# EAGLE design socket (EAGLE 7.2.0)

## Sheet 1 of 7
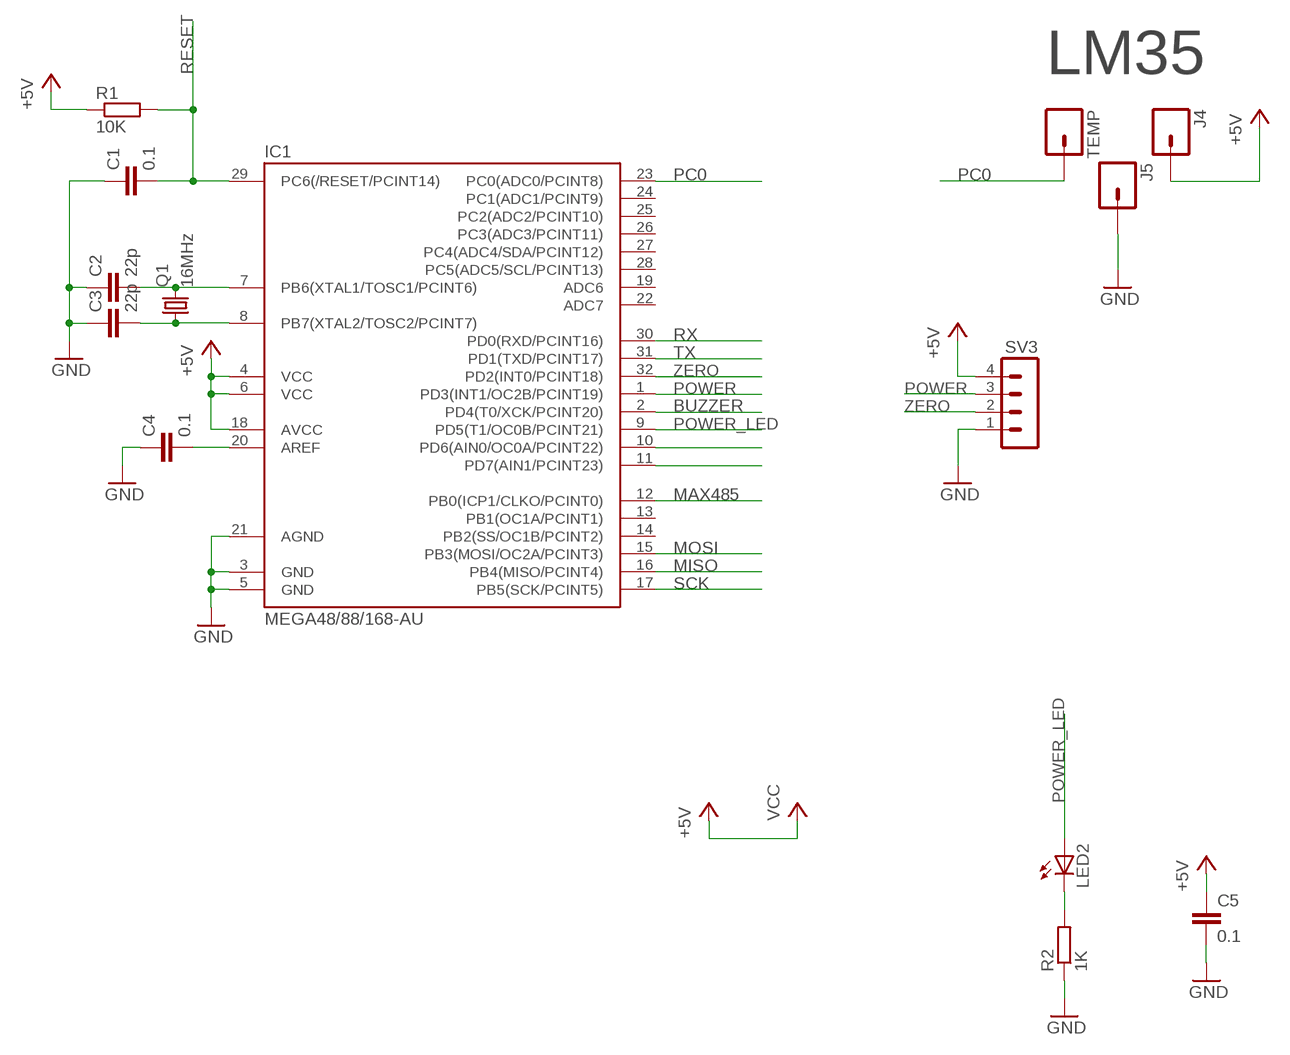
[diagram p0: schematic, sheet 1]

### Parts
C1  0.1  C-EUC0805  [C0805]
C2  22p  C-EUC0805  [C0805]
C3  22p  C-EUC0805  [C0805]
C4  0.1  C-EUC0805  [C0805]
C5  0.1  C-EUC0805  [C0805]
IC1  MEGA48/88/168-AU  [TQFP32-08]
J4  M01PTH_NO_SILK_YES_STOP  [1X01_NO_SILK]
J5  M01PTH_NO_SILK_YES_STOP  [1X01_NO_SILK]
LED2  LEDCHIPLED_0805  [CHIPLED_0805]
Q1  16MHz  CRYSTALHC49U70  [HC49U70]
R1  10K  R-EU_R0805  [R0805]
R2  1K  R-EU_R0805  [R0805]
SV3  MA04-1  [MA04-1]
TEMP  M01PTH_NO_SILK_YES_STOP  [1X01_NO_SILK]

### Nets
+5V: C5.1 IC1.4(VCC) IC1.6(VCC) IC1.18(AVCC) J4.1 R1.1 SV3.4 ; supply symbol labelled VCC ; also sheet 2,4,5,7
BUZZER: IC1.2(PD4(T0/XCK/PCINT20)) ; also sheet 5
GND: C1.1 C2.1 C3.1 C4.1 C5.2 IC1.3(GND) IC1.5(GND) IC1.21(AGND) J5.1 R2.1 SV3.1 ; also sheet 2,4,5,7
MISO: IC1.16(PB4(MISO/PCINT4)) ; also sheet 2
MOSI: IC1.15(PB3(MOSI/OC2A/PCINT3)) ; also sheet 2
N$2: C4.2 IC1.20(AREF)
N$3: C2.2 IC1.7(PB6(XTAL1/TOSC1/PCINT6)) Q1.2
N$4: C3.2 IC1.8(PB7(XTAL2/TOSC2/PCINT7)) Q1.1
N$5: LED2.C R2.2
N$89: IC1.10(PD6(AIN0/OC0A/PCINT22))
N$90: IC1.11(PD7(AIN1/PCINT23))
PB0: IC1.12(PB0(ICP1/CLKO/PCINT0)) ; also sheet 7
PC0: IC1.23(PC0(ADC0/PCINT8)) TEMP.1
PD3: IC1.1(PD3(INT1/OC2B/PCINT19)) SV3.3
PD4: IC1.32(PD2(INT0/PCINT18)) SV3.2
POWER_LED: IC1.9(PD5(T1/OC0B/PCINT21)) LED2.A
RESET: C1.2 IC1.29(PC6(/RESET/PCINT14)) R1.2 ; also sheet 2
RX: IC1.30(PD0(RXD/PCINT16)) ; also sheet 7
SCK: IC1.17(PB5(SCK/PCINT5)) ; also sheet 2
TX: IC1.31(PD1(TXD/PCINT17)) ; also sheet 7
Unconnected: IC1.13(PB1(OC1A/PCINT1)) IC1.14(PB2(SS/OC1B/PCINT2)) IC1.19(ADC6) IC1.22(ADC7) IC1.24(PC1(ADC1/PCINT9)) IC1.25(PC2(ADC2/PCINT10)) IC1.26(PC3(ADC3/PCINT11)) IC1.27(PC4(ADC4/SDA/PCINT12)) IC1.28(PC5(ADC5/SCL/PCINT13))

### Notes on the sheet
- RESET | LM35
- PC0 | PC0
- RX
- TX
- ZERO
- POWER | POWER
- BUZZER | ZERO
- POWER_LED
- MAX485
- MOSI
- MISO
- SCK
- POWER_LED

## Sheet 2 of 7
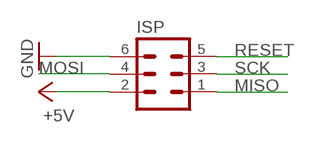
[diagram p1: schematic, sheet 2]

### Parts
ISP  MA03-2  [MA03-2]

### Nets
+5V: ISP.2 ; also sheet 1,4,5,7
GND: ISP.6 ; also sheet 1,4,5,7
MISO: ISP.1 ; also sheet 1
MOSI: ISP.4 ; also sheet 1
RESET: ISP.5 ; also sheet 1
SCK: ISP.3 ; also sheet 1

### Notes on the sheet
- RESET
- MOSI | SCK
- MISO

## Sheet 3 of 7
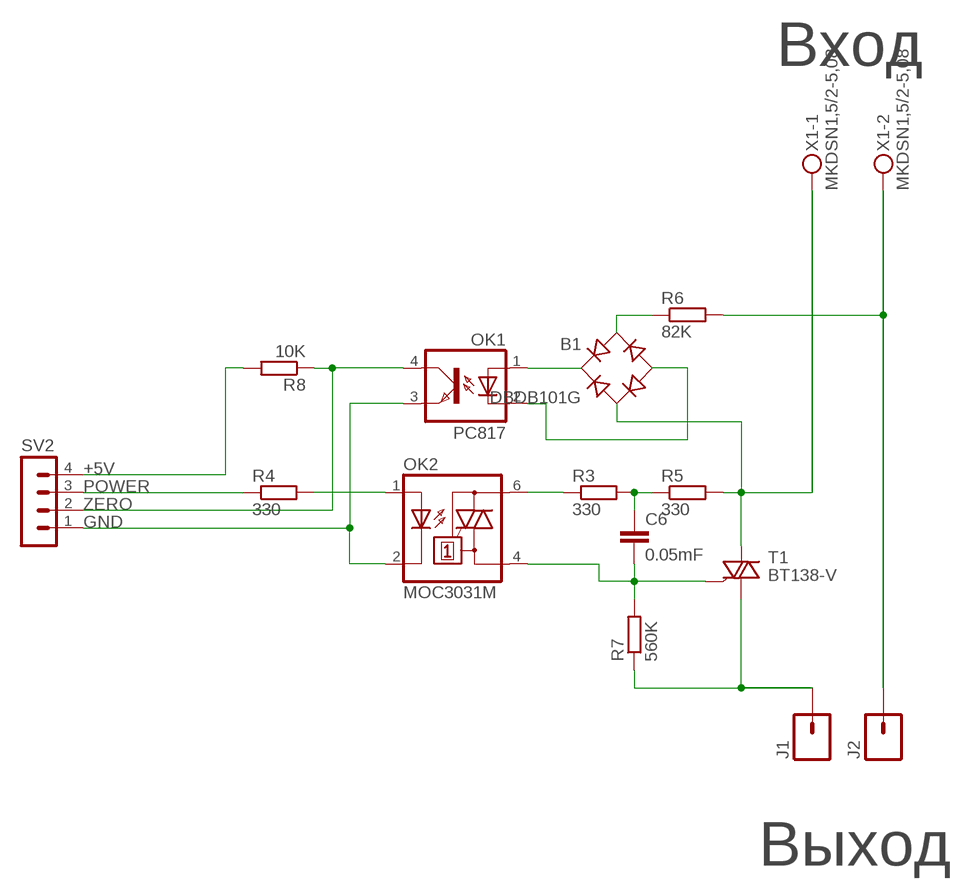
[diagram p2: schematic, sheet 3]

### Parts
B1  DBDB101G  [DB]
C6  0.05mF  C-EUC0805  [C0805]
J1  M01NOSILK-KIT  [1X01NS-KIT]
J2  M01NOSILK-KIT  [1X01NS-KIT]
OK1  PC817  [DIL04]
OK2  MOC3031M  [DIL06]
R3  330  R-EU_M0805  [M0805]
R4  330  R-EU_M0805  [M0805]
R5  330  R-EU_M0805  [M0805]
R6  82K  R-EU_0309/10  [0309/10]
R7  560K  R-EU_M0805  [M0805]
R8  10K  R-EU_M0805  [M0805]
SV2  MA04-1  [MA04-1]
T1  BT138-V  [TO220BV]
X1  MKDSN1,5/2-5,08  [MKDSN1,5/2-5,08]

### Nets
N$1: B1.AC2 R5.2 T1.T2(A2) X1.1
N$6: OK2.6(A2) R3.1
N$7: C6.2 OK2.4(A1) R7.2 T1.G
N$8: J1.1 R7.1 T1.T1(A1)
N$9: OK2.1(A) R4.2
N$12: J2.1 R6.2 X1.2
N$13: C6.1 R3.2 R5.1
N$14: B1.+ OK1.1(A)
N$15: B1.- OK1.2(C)
N$16: B1.AC1 R6.1
N$17: R8.2 SV2.4
N$19: OK1.3(EMIT) OK2.2(C) SV2.1
POWER: R4.1 SV2.3
ZERO: OK1.4(COL) R8.1 SV2.2

### Notes on the sheet
- Вход
- +5V
- POWER
- ZERO
- GND
- Выход

## Sheet 4 of 7
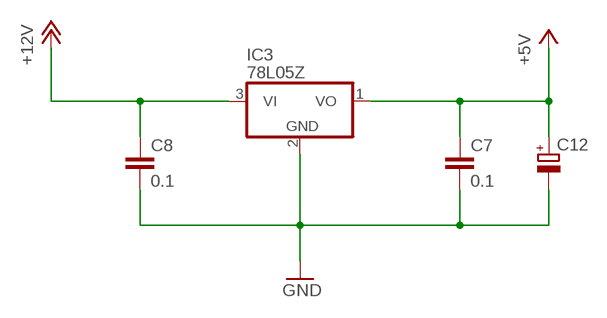
[diagram p3: schematic, sheet 4]

### Parts
C7  0.1  C-EUC0805  [C0805]
C8  0.1  C-EUC0805  [C0805]
C12  CPOL-EUE2,5-6E  [E2,5-6E]
IC3  78L05Z  [TO92]

### Nets
+5V: C7.1 C12.+ IC3.1(VO) ; also sheet 1,2,5,7
+12V: C8.1 IC3.3(VI) ; also sheet 7
GND: C7.2 C8.2 C12.- IC3.2(GND) ; also sheet 1,2,5,7

## Sheet 5 of 7
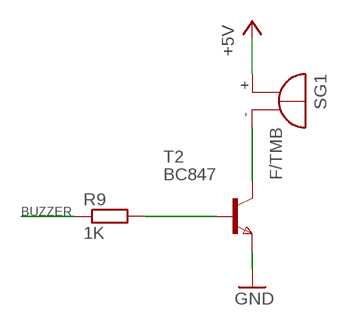
[diagram p4: schematic, sheet 5]

### Parts
R9  1K  R-EU_M1206  [M1206]
SG1  F/TMB  [F/TMB]
T2  BC847  NPNSOT23  [SOT-23]

### Nets
+5V: SG1.+ ; also sheet 1,2,4,7
BUZZER: R9.1 ; also sheet 1
GND: T2.2(E) ; also sheet 1,2,4,7
N$18: R9.2 T2.3(B)
SPEAKER-: SG1.- T2.1(C)

### Notes on the sheet
- BUZZER

## Sheet 6 of 7
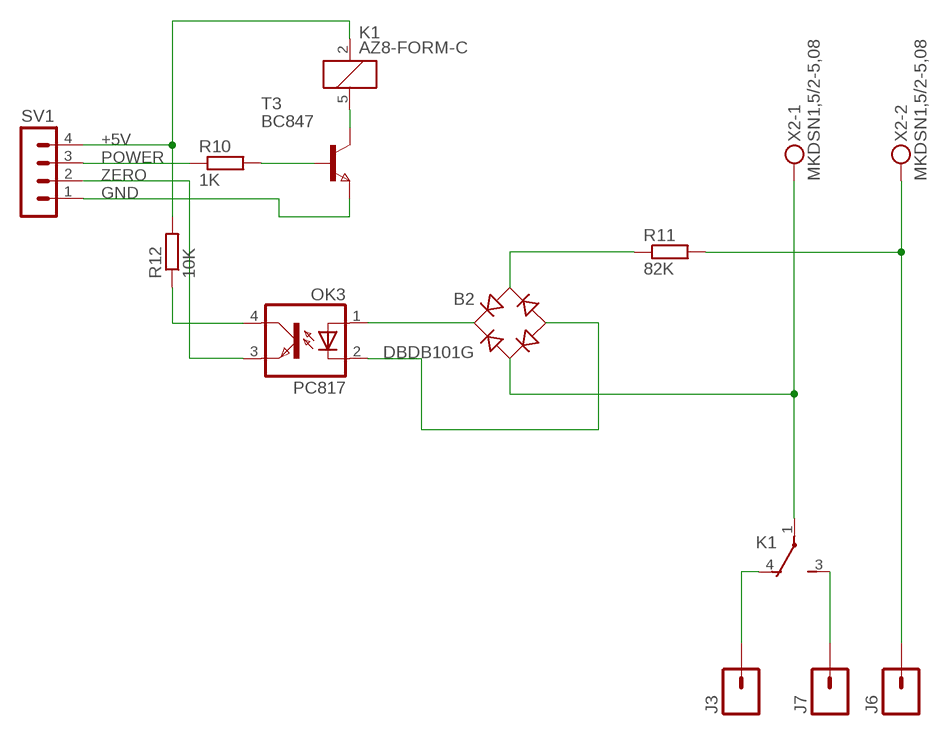
[diagram p5: schematic, sheet 6]

### Parts
B2  DBDB101G  [DB]
J3  M01NOSILK-KIT  [1X01NS-KIT]
J6  M01NOSILK-KIT  [1X01NS-KIT]
J7  M01NOSILK-KIT  [1X01NS-KIT]
K1  AZ8-FORM-C  [AZ8]
OK3  PC817  [DIL04]
R10  1K  R-EU_M0805  [M0805]
R11  82K  R-EU_0309/10  [0309/10]
R12  10K  R-EU_M0805  [M0805]
SV1  MA04-1  [MA04-1]
T3  BC847  NPNSOT23  [SOT-23]
X2  MKDSN1,5/2-5,08  [MKDSN1,5/2-5,08]

### Nets
N$58: R10.1 SV1.3
N$59: R10.2 T3.3(B)
N$60: K1.5 T3.1(C)
N$61: K1.2 R12.2 SV1.4
N$62: J7.1 K1.3(-1:S)
N$63: J3.1 K1.4(-1:O)
N$64: J6.1 R11.2 X2.2
N$65: SV1.1 T3.2(E)
N$66: OK3.4(COL) R12.1
N$67: OK3.3(EMIT) SV1.2
N$68: B2.+ OK3.1(A)
N$69: B2.- OK3.2(C)
N$70: B2.AC1 R11.1
N$71: B2.AC2 K1.1(-1:P) X2.1

### Notes on the sheet
- +5V
- POWER
- ZERO
- GND

## Sheet 7 of 7
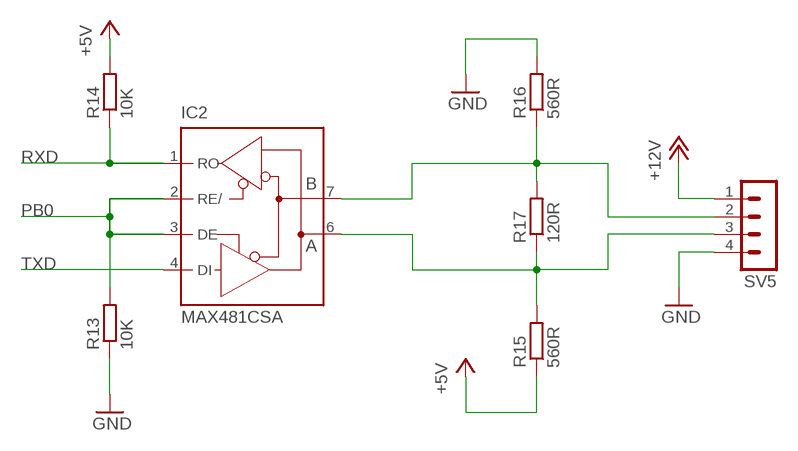
[diagram p6: schematic, sheet 7]

### Parts
IC2  MAX481CSA  [SO08]
R13  10K  R-EU_R0805  [R0805]
R14  10K  R-EU_R0805  [R0805]
R15  560R  R-EU_R0805  [R0805]
R16  560R  R-EU_R0805  [R0805]
R17  120R  R-EU_R0805  [R0805]
SV5  MA04-1  [MA04-1]

### Nets
+5V: R14.2 R15.1 ; also sheet 1,2,4,5
+12V: SV5.1 ; also sheet 4
GND: R13.1 R16.2 SV5.4 ; also sheet 1,2,4,5
N$10: IC2.7(B) R16.1 R17.2 SV5.2
N$11: IC2.6(A) R15.2 R17.1 SV5.3
PB0: IC2.2(RE/) IC2.3(DE) R13.2 ; also sheet 1
RX: IC2.1(RO) R14.1 ; also sheet 1
TX: IC2.4(DI) ; also sheet 1

### Notes on the sheet
- RXD
- PB0
- TXD

## Power pins joined to a net without a drawn wire
+5V: IC2.8(VCC)
GND: IC2.5(GND)

## Library data of the parts
B1 B2 = rectifier:DB?*G: Single Phase 1.0 AMP Glass Passivated Bridge Rectifier Taiwan Semiconductor Co.,Ltd. - TSC Source: http://www.taiwansemi.com/TSCbig5/ezcatfiles/cust/img/img/db101g.pdf http://www.ts.com.tw/db/pictures/modules/PDT/PDT060207001/DBLS201G.pdf
C1-C8 = rcl:C-EU: CAPACITOR, European symbol
C12 = rcl:CPOL-EU: POLARIZED CAPACITOR, European symbol
IC1 = avr-4:MEGA48/88/168
IC2 = maxim:MAX481CSA: RS485 TRANSEIVER; MF: MAXIM; MPN: MAX481CSA; OC_FARNELL: unknown; OC_NEWARK: 90C3817
IC3 = linear:78*: Positive VOLTAGE REGULATOR Source: http://cache.national.com/ds/LM/LM78L05.pdf http://www.fairchildsemi.com/ds/LM/LM7805.pdf
ISP = con-lstb:MA03-2: PIN HEADER; OC_FARNELL: unknown; OC_NEWARK: unknown
J1-J7 TEMP = SparkFun-Connectors:M01: Header 1 Standard 1-pin 0.1" header. Use with straight break away headers (SKU : PRT-00116), right angle break away headers (PRT-00553), swiss pins (PRT-00743), machine pins (PRT-00117), and female headers (PRT-00115). SMTSO-256-ET is a "flush mount" nut for a 4-40 screw. The older package used to be too tight, and did not allow it to sit properly thru the drill hit. The latest (0.165DIA) fits nice and snug.
K1 = relay:AZ8-FORM-C: MINIATURE PC BOARD RELAY Form C Source: www.azettler.com .. AZ8-1ch-12DSE.PDF; OC_FARNELL: unknown; OC_NEWARK: unknown
LED2 = led:LED: LED OSRAM: - CHIPLED LG R971, LG N971, LY N971, LG Q971, LY Q971, LO R971, LY R971 LH N974, LH R974 LS Q976, LO Q976, LY Q976 LO Q996 - Hyper CHIPLED LW Q18S LB Q993, LB Q99A, LB R99A - SideLED LS A670, LO A670, LY A670, LG A670, LP A670 LB A673, LV A673, LT A673, LW A673 LH A674 LY A675 LS A676, LA A676, LO A676, LY A676, LW A676 LS A679, LY A679, LG A679 - Hyper Micro SIDELED® LS Y876, LA Y876, LO Y876, LY Y876 LT Y87S - SmartLED LW L88C, LW L88S LB L89C, LB L89S, LG L890 LS L89K, LO L89K, LY L89K LS L896, LA L896, LO L896, LY L896 - TOPLED LS T670, LO T670, LY T670, LG T670, LP T670 LSG T670, LSP T670, LSY T670, LOP T670, LYG T670 LG T671, LOG T671, LSG T671 LB T673, LV T673, LT T673, LW T673 LH T674 LS T676, LA T676, LO T676, LY T676, LB T676, LH T676, LSB T676, LW T676 LB T67C, LV T67C, LT T67C, LS T67K, LO T67K, LY T67K, LW E67C LS E67B, LA E67B, LO E67B, LY E67B, LB E67C, LV E67C, LT E67C LW T67C LS T679, LY T679, LG T679 LS T770, LO T770, LY T770, LG T770, LP T770 LB T773, LV T773, LT T773, LW T773 LH T774 LS E675, LA E675, LY E675, LS T675 LS T776, LA T776, LO T776, LY T776, LB T776 LHGB T686 LT T68C, LB T68C - Hyper Mini TOPLED® LB M676 - Mini TOPLED Santana® LG M470 LS M47K, LO M47K, LY M47K Source: http://www.osram.convergy.de LUXEON: - LUMILED® LXK2-PW12-R00, LXK2-PW12-S00, LXK2-PW14-U00, LXK2-PW14-V00 LXK2-PM12-R00, LXK2-PM12-S00, LXK2-PM14-U00 LXK2-PE12-Q00, LXK2-PE12-R00, LXK2-PE12-S00, LXK2-PE14-T00, LXK2-PE14-U00 LXK2-PB12-K00, LXK2-PB12-L00, LXK2-PB12-M00, LXK2-PB14-N00, LXK2-PB14-P00, LXK2-PB14-Q00 LXK2-PR12-L00, LXK2-PR12-M00, LXK2-PR14-Q00, LXK2-PR14-R00 LXK2-PD12-Q00, LXK2-PD12-R00, LXK2-PD12-S00 LXK2-PH12-R00, LXK2-PH12-S00 LXK2-PL12-P00, LXK2-PL12-Q00, LXK2-PL12-R00 Source: www.luxeon.com KINGBRIGHT: KA-3528ASYC Source: www.kingbright.com
OK1 OK3 = optocoupler:PC817: SHARP OPTO COUPLER; MPN: PC817X4J000F; OC_FARNELL: 9707727; OC_NEWARK: 97K7059
OK2 = optocoupler:MOC30*: 6-Pin DIP Zero-Cross Optoisolators Triac Driver Output (250/400 Volt Peak) Source: Data sheet <http://www.fairchildsemi.com/ds/MO/MOC3031M.pdf> The old path of data sheet not more available 2013-05-06.; MF: FAIRCHILD SEMICONDUCTOR; MPN: MOC3031M; OC_FARNELL: 9875964; OC_NEWARK: 78K6089
Q1 = crystal:CRYSTAL: CRYSTAL; OC_FARNELL: unknown; OC_NEWARK: unknown
R1-R12 = rcl:R-EU_: RESISTOR, European symbol
R13-R17 = resistor:R-EU_: RESISTOR, European symbol
SG1 = buzzer:F/TMB: BUZZER Source: Buerklin; OC_FARNELL: unknown; OC_NEWARK: unknown
SV1-SV3 SV5 = con-lstb:MA04-1: PIN HEADER; OC_FARNELL: unknown; OC_NEWARK: unknown
T1 = triac:BT138: TRIAC Source: http://www.semiconductors.philips.com BT138_SERIES_2.pdf
T2 T3 = zetex:NPNSOT23: NPN TRANSISTOR; MPN: DSS20201L-7; OC_FARNELL: 1710688; OC_NEWARK: 25R4555
X1 X2 = con-phoenix-508:MKDSN1,5/2-5,08: MKDSN 1,5/ 2-5,08 Printklemme Nennstrom: 13,5 A Nennspannung: 250 V Rastermaß: 5,08 mm Polzahl: 2 Anschlussart: Schraubanschluss Montage: Löten Anschlussrichtung Leiter/Platine: 0 ° Artikelnummer: 1729128 Source: http://eshop.phoenixcontact.com .. 1729128.pdf

## Board
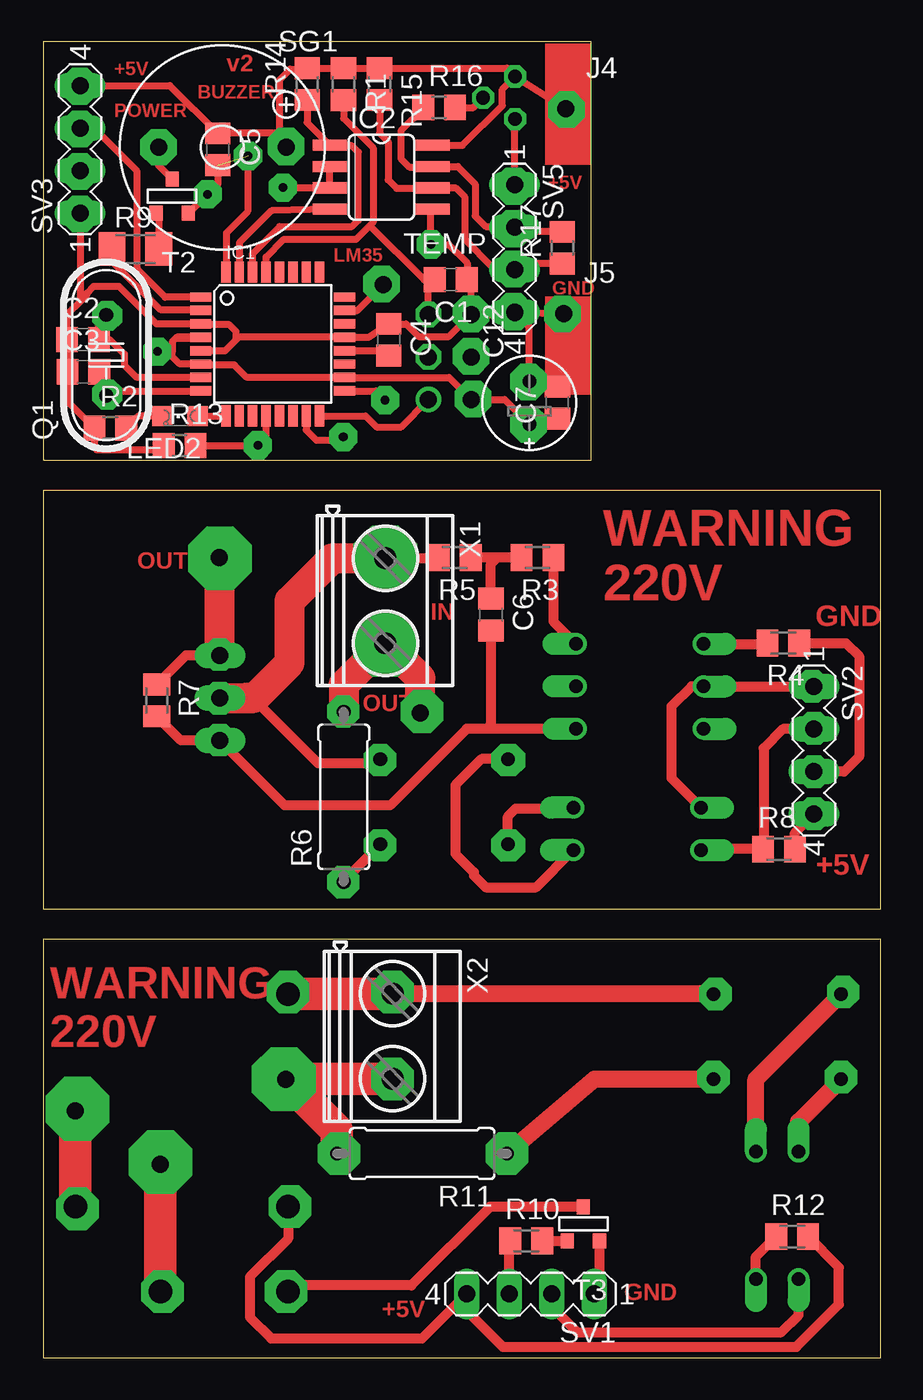
[diagram p7: board, top side]
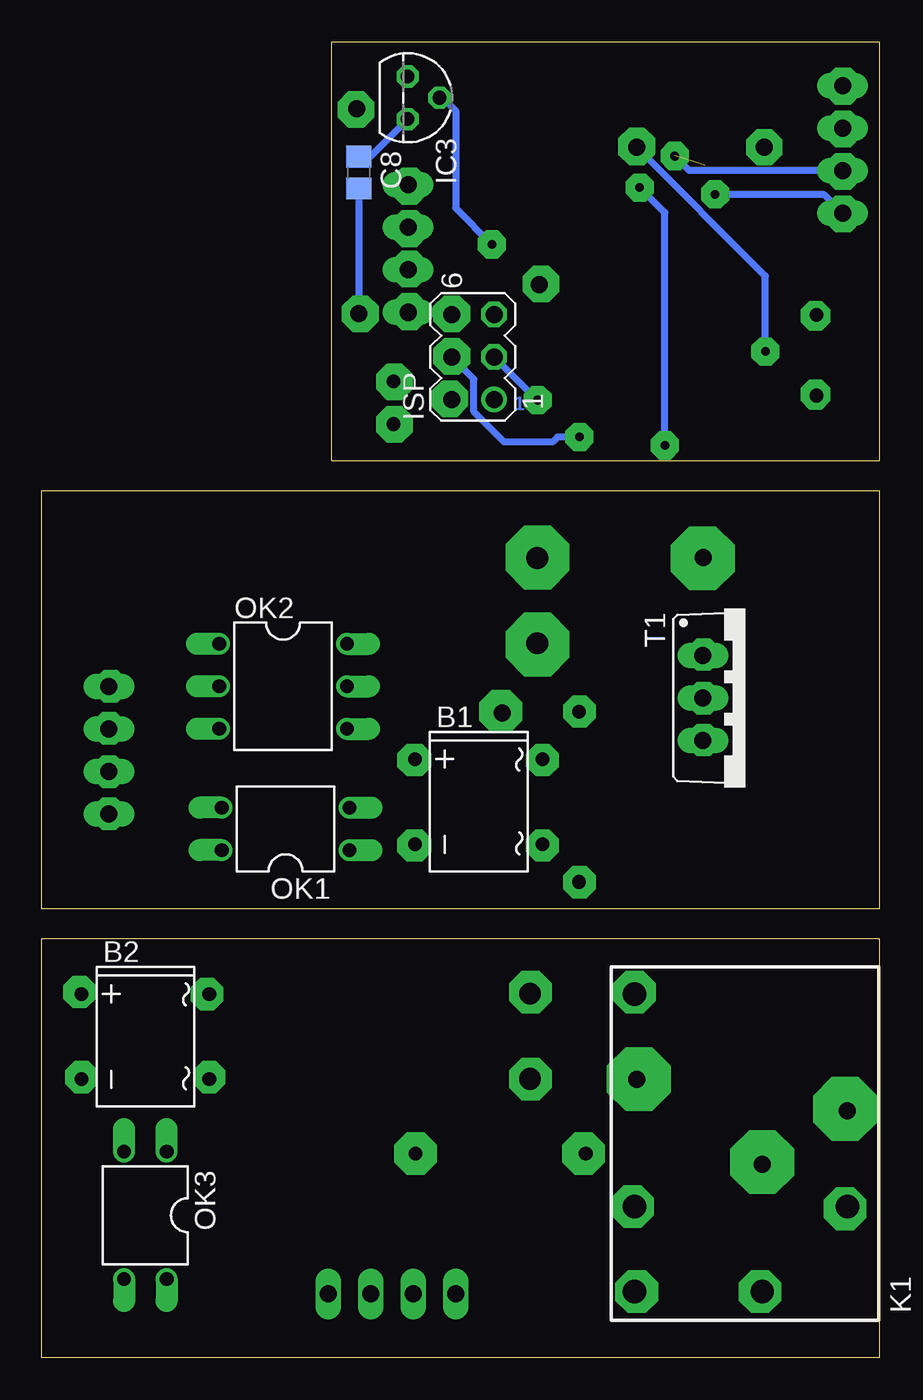
[diagram p8: board, bottom side, seen from below]

Size 50 x 78.6 mm. Coordinates in mm from the lower left corner, seen from the top.
Outline: 0,25.02 50,25.02
Outline: 0,25 0,0 50,0 50,25
Outline: 0,26.8 50,26.8 50,51.8 0,51.8 0,26.8
Outline: 0,78.6 0,53.6 32.7,53.6 32.7,78.6 0,78.6
Copper layers (1*16): Top 0.035mm / dielectric 1.5mm / Bottom 0.035mm
Design rules "default": minimum track width 10mil, minimum drill 24mil, track to track 8mil, track to pad 8mil, pad to pad 8mil, via to via 8mil, smd to smd 8mil, copper to edge 40mil, drill to drill 8mil, minimum pad ring 10mil, minimum via ring 8mil, stop-mask expansion 4mil, vias tented up to drill 0mil, thermal gap 10mil

### Footprints (pad centres in the part's own frame; a part is rotated, then mirrored left to right if it is on the bottom)
DB = drill 0.813: + -2.54,-3.81 | drill 0.813 octagon: - 2.54,-3.81; AC1 2.54,3.81; AC2 -2.54,3.81
C0805 = smd 1.3 x 1.5: 1 -0.95,0; 2 0.95,0
E2,5-6E = drill 0.813 pad 1.575: + -1.27,0 | drill 0.813 pad 1.575 octagon: - 1.27,0
TQFP32-08 = smd 1.27 x 0.559: 1 -4.293,2.8; 2 -4.293,2; 3 -4.293,1.2; 4 -4.293,0.4; 5 -4.293,-0.4; 6 -4.293,-1.2; 7 -4.293,-2; 8 -4.293,-2.8; 17 4.293,-2.8; 18 4.293,-2; 19 4.293,-1.2; 20 4.293,-0.4; 21 4.293,0.4; 22 4.293,1.2; 23 4.293,2; 24 4.293,2.8 | smd 0.559 x 1.27: 9 -2.8,-4.293; 10 -2,-4.293; 11 -1.2,-4.293; 12 -0.4,-4.293; 13 0.4,-4.293; 14 1.2,-4.293; 15 2,-4.293; 16 2.8,-4.293; 25 2.8,4.293; 26 2,4.293; 27 1.2,4.293; 28 0.4,4.293; 29 -0.4,4.293; 30 -1.2,4.293; 31 -2,4.293; 32 -2.8,4.293
SO08 = smd 0.66 x 2.032: 1 -1.905,-3.073; 2 -0.635,-3.073; 3 0.635,-3.073; 4 1.905,-3.073; 5 1.905,3.073; 6 0.635,3.073; 7 -0.635,3.073; 8 -1.905,3.073
TO92 = drill 0.813 octagon: 1 -1.27,0; 2 0,1.905; 3 1.27,0
MA03-2 = drill 1.016: 1 -2.54,-1.27 | drill 1.016 octagon: 2 -2.54,1.27; 3 0,-1.27; 4 0,1.27; 5 2.54,-1.27; 6 2.54,1.27
1X01NS-KIT = drill 1.016 pad 1.88: 1 0,0
1X01_NO_SILK = drill 1.016 pad 1.88: 1 0,0
AZ8 = drill 1.4 pad 2: 1 8.89,6.35; 2 -3.81,6.35; 3 -8.89,-1.27; 4 -3.81,-6.35; 5 -8.89,6.35
CHIPLED_0805 = smd 1.2 x 1.2: A 0,-1.05; C 0,1.05
DIL04 = drill 0.813 offset: 1 -1.27,-3.81; 2 1.27,-3.81; 3 1.27,3.81; 4 -1.27,3.81
DIL06 = drill 0.813 offset: 1 -2.54,-3.81; 2 0,-3.81; 3 2.54,-3.81; 4 2.54,3.81; 5 0,3.81; 6 -2.54,3.81
HC49U70 = drill 0.813: 1 -2.413,0; 2 2.413,0
R0805 = smd 1.3 x 1.5: 1 -0.95,0; 2 0.95,0
M0805 = smd 1.3 x 1.6: 1 -0.95,0; 2 0.95,0
0309/10 = drill 0.813 octagon: 1 -5.08,0; 2 5.08,0
M1206 = smd 1.6 x 2: 1 -1.4,0; 2 1.4,0
F/TMB = drill 1.016 pad 2.159 octagon: + 3.81,0; - -3.81,0
MA04-1 = drill 1.016 long: 1 -3.81,0; 2 -1.27,0; 3 1.27,0; 4 3.81,0
TO220BV = drill 1.016 long: G 2.54,-2.54; T1 -2.54,-2.54; T2 0,-2.54
SOT-23 = smd 0.787 x 0.889: 1 0.025,-1.016; 2 -0.94,1.016; 3 0.991,1.016
MKDSN1,5/2-5,08 = drill 1.3 pad 2: 1 -2.561,0.025; 2 2.519,0.025

### Placement (x,y rotation side)
B1  23.92,33.21 270 bottom
B2  43.81,19.18 270 bottom
C1  24.32,64.39 180 top
C2  2.36,60.81 0 top
C3  2.38,58.88 0 top
C4  20.61,60.8 270 top
C5  10.41,72.18 270 top
C6  26.72,44.39 270 top
C7  30.69,57.04 90 top
C8  31.07,70.79 270 bottom
C12  29.01,57.04 90 top
IC1  13.69,60.55 0 top
IC2  20.18,70.51 270 top
IC3  28.16,75.26 270 bottom
ISP  24.26,59.78 90 bottom
J1  10.5,47.8 0 top
J2  22.5,38.5 0 top
J3  1.91,14.73 0 top
J4  31.2,74.6 0 top
J5  31.07,62.36 0 top
J6  14.48,16.64 0 top
J7  6.99,11.56 0 top
K1  8.26,12.83 90 bottom
LED2  8.15,56.24 90 top
OK1  35.45,31.59 90 bottom
OK2  35.6,40.1 270 bottom
OK3  43.81,8.51 180 bottom
Q1  3.75,59.88 90 top
R1  17.92,76.07 270 top
R2  3.99,55.53 0 top
R3  29.5,47.79 180 top
R4  44.18,42.69 180 top
R5  24.56,47.79 180 top
R6  17.93,33.5 90 top
R7  6.77,39.26 270 top
R8  43.92,30.38 0 top
R9  5.49,66.22 0 top
R10  28.83,6.98 0 top
R11  22.61,12.19 180 top
R12  44.7,7.24 0 top
R13  8.13,54.48 0 top
R14  15.75,76.07 90 top
R15  20.07,76.07 270 top
R16  23.62,74.68 0 top
R17  30.99,66.29 90 top
SG1  10.68,72.3 0 top
SV1  29.08,3.81 180 top
SV2  46,36.28 270 top
SV3  2.19,72.18 90 top
SV5  28.13,66.25 270 top
T1  7.99,39.41 270 bottom
T2  7.71,69.38 180 top
T3  32.26,8 180 top
TEMP  20.3,64.1 0 top
X1  20.39,45.2 270 top
X2  20.83,19.18 270 top

### Tracks (layer width: path | path; a pad name or v marks a point on that pad's centre or on a via)
+5V  (via drill 0.51 pad 1.68)
  Top 0.406: 7.7,60.1 7.7,59.8 8.15,59.35 IC1.6 9.45,59.3 11.4,59.3 12.15,58.55 IC1.18 24.22,58.55 ISP.2 27.54,57.24 C12.+ 30.37,55.77 C7.1 | 7.9,60.9 7.7,60.7 7.7,60.1 | 7.9,60.9 9.35,60.9 IC1.4 7.95,60.95 7.9,60.9 | SV3.4 7.55,75.99 C5.1 10.44,73.15 14.1,73.15 | 7.7,60.1 v6.8,60.1 | J4.1 28.19,76.5 IC3.1 | IC2.8 25.02,72.41 27.4,74.8 27.4,75.77 IC3.1 | SG1.+ 14.49,72.76 14.1,73.15 | 14.1,73.15 14.1,76.33 14.73,76.96 15.69,76.96 R14.2 R1.1 R15.1 27.66,77.02 IC3.1
  Bottom 0.406: v6.8,60.1 6.8,64.61 SG1.+
+12V
  Top 0.406: SV5.1 28.13,73.96 IC3.3
  Bottom 0.406: C8.1 30.4,71.74 IC3.3
BUZZER
  Top 0.406: R9.1 4.09,65.51 6.99,62.61 9.33,62.61 IC1.2
GND  (via drill 0.51 pad 1.68)  (1 unrouted)
  Top 0.406: 1.43,60.79 C2.1 | IC1.5 10.85,60.15 11.5,60.8 | 11.5,60.8 11.5,61.3 11.1,61.7 9.45,61.7 IC1.3 6.75,61.75 4.5,64 3,64 2.6,63.6 2.6,63.5 2.19,63.09 | 11.5,60.8 11.65,60.95 IC1.21 19.41,60.95 C4.1 21.65,61.75 22.4,61 24.21,61 ISP.6 | 1.43,60.79 1.43,62.33 2.19,63.09 | SV3.1 2.19,63.09 | C5.2 10.41,70.12 T2.2 8.66,68.36 v9.8,69.5 | C7.2 30.37,58.31 C12.- 29.01,61.56 SV5.4 | J5.1 29.75,62.36 SV5.4 | IC2.5 23.13,68.48 v23.13,66.5 24.2,66.5 25.3,65.4 25.3,64.42 C1.1 25.53,64.13 ISP.6 | ISP.6 28.01,62.32 SV5.4 | 1.43,60.79 C3.1 1.43,57.14 R2.1 3.04,54.36 3.17,54.23 6.92,54.23 R13.1 | R16.2 25.67,74.68 IC3.2
  Bottom 0.406: v9.8,69.5 3.32,69.5 SV3.1 | IC3.2 26.06,75.26 25.3,74.5 25.3,68.67 v23.13,66.5 | C8.2 J5.1
  other vias: 12.21,71.78
MISO
  Top 0.406: IC1.16 19.24,56.25 19.9,55.6 21.35,55.6 ISP.1
MOSI  (via drill 0.51 pad 1.68)
  Top 0.406: IC1.15 15.69,55.41 16.3,54.8 17.7,54.8 v17.9,55
  Bottom 0.406: ISP.4 24.2,58.45 24.2,56.5 22.4,54.7 19.5,54.7 19.2,55 v17.9,55
N$1
  Top 0.61: B1.AC2 19.86,35.5 16.4,35.5 12.49,39.41 12.1,39.41 | X1.1 23.58,47.76 R5.2
  Top 1.778: T1.T2 12.1,39.41 12.61,39.41 14.7,41.5 14.7,45.2 17.26,47.76 X1.1
N$2
  Top 0.406: IC1.20 19.91,60.15 C4.2
N$3
  Top 0.406: IC1.7 5.57,58.55 4.83,59.29 4.83,59.94 3.96,60.81 C2.2 3.31,61.85 Q1.2
N$4
  Top 0.406: IC1.8 4.03,57.75 Q1.1 3.33,57.88 C3.2
N$5
  Top 0.406: LED2.C 5.64,56.24 R2.2
N$6
  Top 0.61: R3.1 30.45,43.98 OK2.6
N$7
  Top 0.61: R7.2 8.21,36.87 T1.G 14.4,33 20.7,33 25.26,37.56 26.5,37.56 | OK2.4 26.5,37.56 | C6.2 26.72,37.78 26.5,37.56
N$8
  Top 0.61: T1.T1 8.51,41.95 R7.1
  Top 1.778: T1.T1 10.53,47.77 J1.1
N$9
  Top 0.61: OK2.1 43.18,42.64 R4.2
N$10
  Top 0.406: R17.2 28.4,67.24 SV5.2 28.08,67.56 26.42,67.56 25.78,68.2 25.78,70.1 24.74,71.14 IC2.7 23.23,71.12 21.84,71.12 21.34,71.63 21.34,73.28 22.67,74.61 R16.1
N$11
  Top 0.406: R17.1 28.5,65.34 SV5.3 27.96,65.15 26.8,65.15 25.15,66.8 25.15,69.34 24.62,69.87 IC2.6 23.23,69.85 21.08,69.85 20.57,70.36 20.57,72.64 20.07,73.15 R15.2
N$12
  Top 1.778: R6.2 17.93,40.19 X1.2 22.5,40.59 J2.1
N$13
  Top 0.61: R3.2 27.1,47.79 | 27.1,47.79 R5.1 | C6.1 26.72,47.41 27.1,47.79
N$14
  Top 0.61: B1.+ 26.15,35.75 24.6,34.2 24.6,30.1 25.7,29 25.7,28.8 26.4,28.1 29.42,28.1 OK1.1
N$15
  Top 0.61: B1.- 27.73,32.33 28.2,32.8 31.58,32.8 OK1.2
N$16
  Top 0.61: R6.1 17.93,28.49 B1.AC1
N$17
  Top 0.61: R8.2 44.87,31.34 SV2.4
N$18
  Top 0.406: T2.3 6.89,68.36 R9.2
N$19  (via drill 0.51 pad 1.93)
  Top 0.61: SV2.1 v45.9,40.1 OK2.2 38.7,40.1 37.5,38.9 37.5,34.62 OK1.3
N$20  (via drill 0.51 pad 3.81)
  other vias: 10.54,47.75
N$21  (via drill 0.51 pad 1.78)
  other vias: 3.81,62.23
N$22  (via drill 0.51 pad 3.81)
  other vias: 20.4,42.6
N$23  (via drill 0.51 pad 1.93)
  other vias: 10.5,42
N$24  (via drill 0.51 pad 1.93)
  other vias: 10.5,39.4
N$25  (via drill 0.51 pad 1.93)
  other vias: 10.5,36.9
N$26  (via drill 0.51 pad 1.93)
  other vias: 20.1,35.7
N$27  (via drill 0.51 pad 1.93)
  other vias: 27.8,35.7
N$28  (via drill 0.51 pad 1.93)
  other vias: 20.1,30.6
N$29  (via drill 0.51 pad 1.93)
  other vias: 17.9,28.4
N$30  (via drill 0.51 pad 1.93)
  other vias: 27.8,30.6
N$31  (via drill 0.51 pad 1.93)
  other vias: 17.9,38.6
N$32  (via drill 0.51 pad 1.93)
  other vias: 27.7,35.7
N$33  (via drill 0.51 pad 1.93)
  other vias: 27.7,30.6
N$34  (via drill 0.51 pad 1.93)
  other vias: 46,37.6
N$35  (via drill 0.51 pad 1.93)
  other vias: 46,35
N$36  (via drill 0.51 pad 1.93)
  other vias: 46,32.5
N$37  (via drill 0.51 pad 2.54)
  other vias: 22.6,38.6
N$38  (via drill 0.51 pad 1.78)
  other vias: 3.81,57.53
N$39  (via drill 0.51 pad 2.18)
  other vias: 31.24,74.55
N$40  (via drill 0.51 pad 2.18)
  other vias: 30.99,62.36
N$41  (via drill 0.51 pad 2.18)
  other vias: 2.16,75.95
N$42  (via drill 0.51 pad 2.18)
  other vias: 2.16,73.41
N$43  (via drill 0.51 pad 2.18)
  other vias: 2.16,70.87
N$44  (via drill 0.51 pad 2.18)
  other vias: 2.16,68.33
N$45  (via drill 0.51 pad 2.18)
  other vias: 28.07,69.98
N$46  (via drill 0.51 pad 2.18)
  other vias: 28.07,67.44
N$47  (via drill 0.51 pad 2.18)
  other vias: 28.07,65.02
N$48  (via drill 0.51 pad 2.18)
  other vias: 28.07,62.48
N$49  (via drill 0.51 pad 2.18)
  other vias: 25.53,59.82
N$50  (via drill 0.51 pad 2.18)
  other vias: 25.53,62.36
N$51  (via drill 0.51 pad 2.18)
  other vias: 25.65,57.28
N$54  (via drill 0.51 pad 2.18)
  other vias: 28.96,55.75
N$55  (via drill 0.51 pad 2.18)
  other vias: 28.96,58.29
N$56  (via drill 0.51 pad 2.18)
  other vias: 20.19,64.14
N$57  (via drill 0.51 pad 2.18)
  other vias: 14.48,72.39
N$58
  Top 0.61: SV1.3 27.81,6.92 R10.1
N$59
  Top 0.61: R10.2 T3.3
N$60
  Top 0.61: T3.1 26.67,9.02 21.97,4.32 14.99,4.32 K1.5
N$61
  Top 0.61: K1.2 14.61,7.11 12.32,4.83 12.32,2.41 13.59,1.14 22.61,1.14 SV1.4 25.27,2.79 27.43,0.64 44.96,0.64 47.5,3.18 47.5,5.39 R12.2
N$62
  Top 1.93: K1.3 J7.1
N$63
  Top 1.93: K1.4 J3.1
N$64
  Top 1.93: X2.2 14.5,16.66 J6.1 17.53,13.59 R11.2
N$65
  Top 0.61: T3.2 33.2,4.12 SV1.1
N$66
  Top 0.61: OK3.4 42.55,6.03 R12.1
N$67
  Top 0.61: SV1.2 30.35,3.05 31.88,1.52 44.07,1.52 45.09,2.54 OK3.3
N$68
  Top 1.016: OK3.1 42.55,16.64 B2.+
N$69
  Top 1.016: OK3.2 45.09,14.1 B2.-
N$70
  Top 1.016: B2.AC1 32.89,16.64 R11.1
N$71
  Top 1.016: B2.AC2 20.34,21.72 20.32,21.74
  Top 1.93: X2.1 20.32,21.74 14.63,21.74 K1.1
N$72  (via drill 0.51 pad 3.81)
  other vias: 2.03,14.86
N$73  (via drill 0.51 pad 3.81)
  other vias: 6.99,11.68
N$74  (via drill 0.51 pad 3.81)
  other vias: 14.35,16.64
N$75  (via drill 0.51 pad 2.54)
  other vias: 2.03,8.89
N$76  (via drill 0.51 pad 2.54)
  other vias: 7.11,3.94
N$77  (via drill 0.51 pad 2.54)
  other vias: 14.73,9.02
N$78  (via drill 0.51 pad 2.54)
  other vias: 14.48,3.94
N$79  (via drill 0.51 pad 2.54)
  other vias: 14.61,21.84
N$80  (via drill 0.51 pad 2.54)
  other vias: 20.83,21.84
N$81  (via drill 0.51 pad 2.54)
  other vias: 20.83,16.64
N$82  (via drill 0.51 pad 2.54)
  other vias: 27.69,12.19
N$83  (via drill 0.51 pad 2.54)
  other vias: 17.65,12.19
N$84  (via drill 0.51 pad 1.93)
  other vias: 40.13,21.72
N$85  (via drill 0.51 pad 1.93)
  other vias: 47.75,21.84
N$86  (via drill 0.51 pad 1.93)
  other vias: 47.62,16.76
N$87  (via drill 0.51 pad 1.93)
  other vias: 40.01,16.76
N$222  (via drill 0.51 pad 3.81)
  other vias: 20.41,47.8
PB0  (via drill 0.51 pad 1.68)
  Top 0.406: IC2.2 IC2.3 17.08,69.9 v14.3,69.9 | R13.2 12.79,54.48 v12.8,54.5 13.29,54.99 IC1.12
  Bottom 0.406: v12.8,54.5 12.8,68.4 v14.3,69.9
PC0
  Top 0.406: IC1.23 18.75,62.55 TEMP.1
PD3
  Top 0.406: IC1.1 7.26,63.35 5.59,65.02 5.59,70.87 3.05,73.41 2.23,73.41 SV3.3
PD4  (via drill 0.51)
  Top 0.406: v12.19,71.75 12.19,68.45 10.92,67.18 10.92,64.87 IC1.32
  Bottom 0.406: SV3.2 11.34,70.91 v12.19,71.75
POWER
  Top 0.61: R4.1 47.91,42.69 48.7,41.9 48.7,35.9 47.81,35.01 SV2.3
POWER_LED
  Top 0.406: LED2.A 10.87,56.24 IC1.9
RESET
  Top 0.406: ISP.5 22.99,64.01 C1.2 22.73,64.39 19.49,67.63 | IC1.29 13.29,65.74 14.35,66.8 18.67,66.8 19.49,67.63 | 19.49,67.63 19.68,67.82 19.68,72.26 17.92,74.03 R1.2
RX
  Top 0.406: IC1.30 12.49,65.96 14.1,67.56 18.41,67.56 18.8,67.95 18.8,72.01 18.41,72.39 17.13,72.39 IC2.1 15.75,73.77 R14.1
SCK  (via drill 0.51 pad 1.68)
  Top 0.406: IC1.17 19.85,57.75 v20.4,57.2
  Bottom 0.406: v20.4,57.2 v20.41,57.2 ISP.3
SPEAKER-
  Top 0.406: SG1.- 6.87,71.21 T2.1
TX
  Top 0.406: IC2.4 13.61,68.5 11.7,66.6 11.7,64.85 IC1.31
ZERO
  Top 0.61: SV2.2 44.15,37.55 43,36.4 43,30.41 R8.1 39.32,30.38 OK1.4
(copper drawn outside any net)
  shapes: Top area x2

### Text on the board
Top: +5V | v2 | BUZZER | POWER | +5V | LM35 | GND | OUT | WARNING / 220V | IN | GND | OUT | +5V | WARNING / 220V | GND | +5V
Bottom: 1